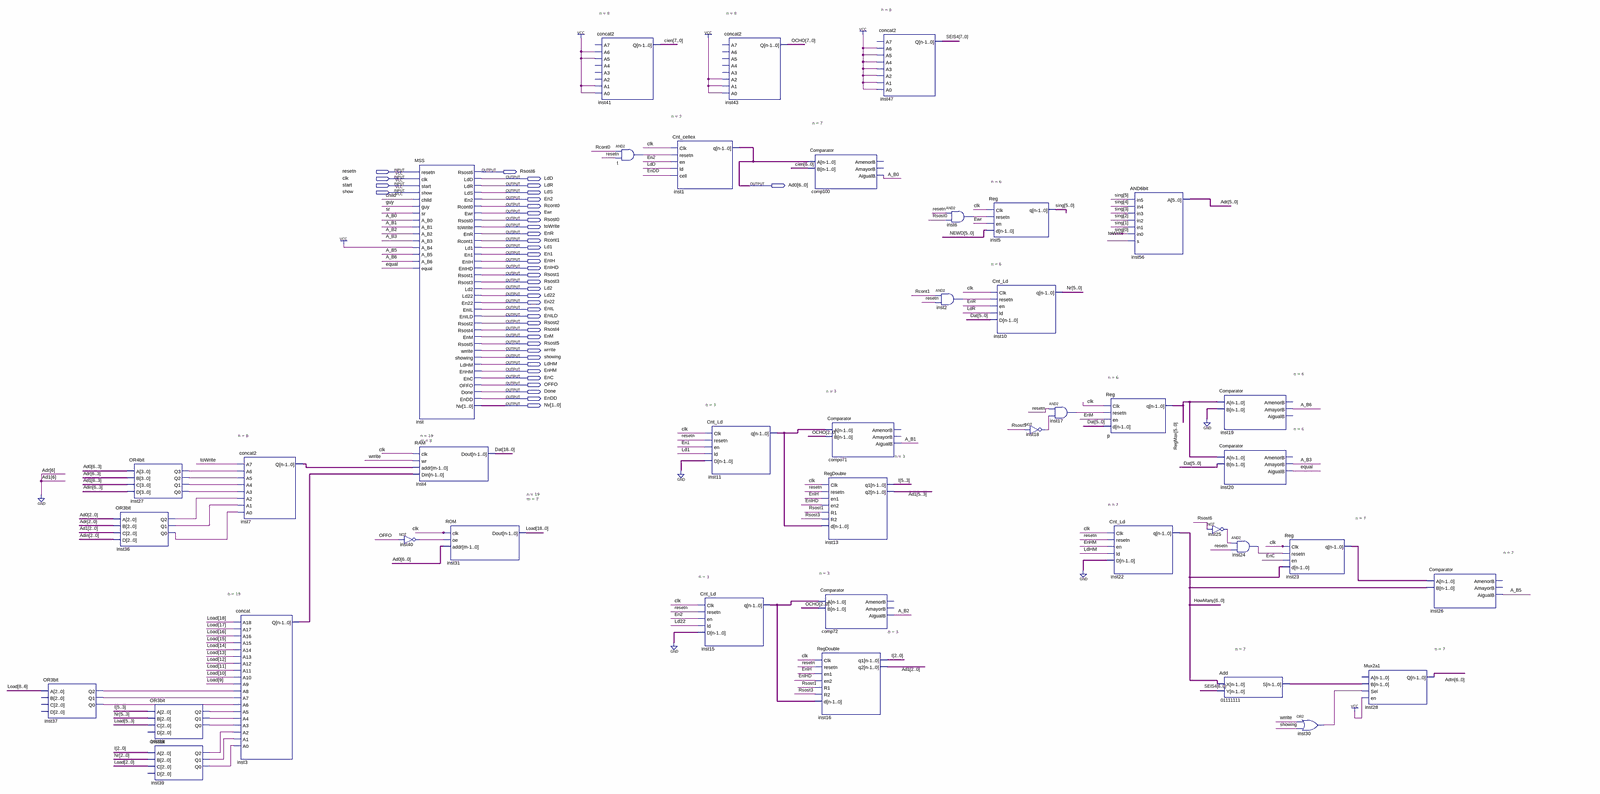
[diagram p0: schematic sheet, whole]
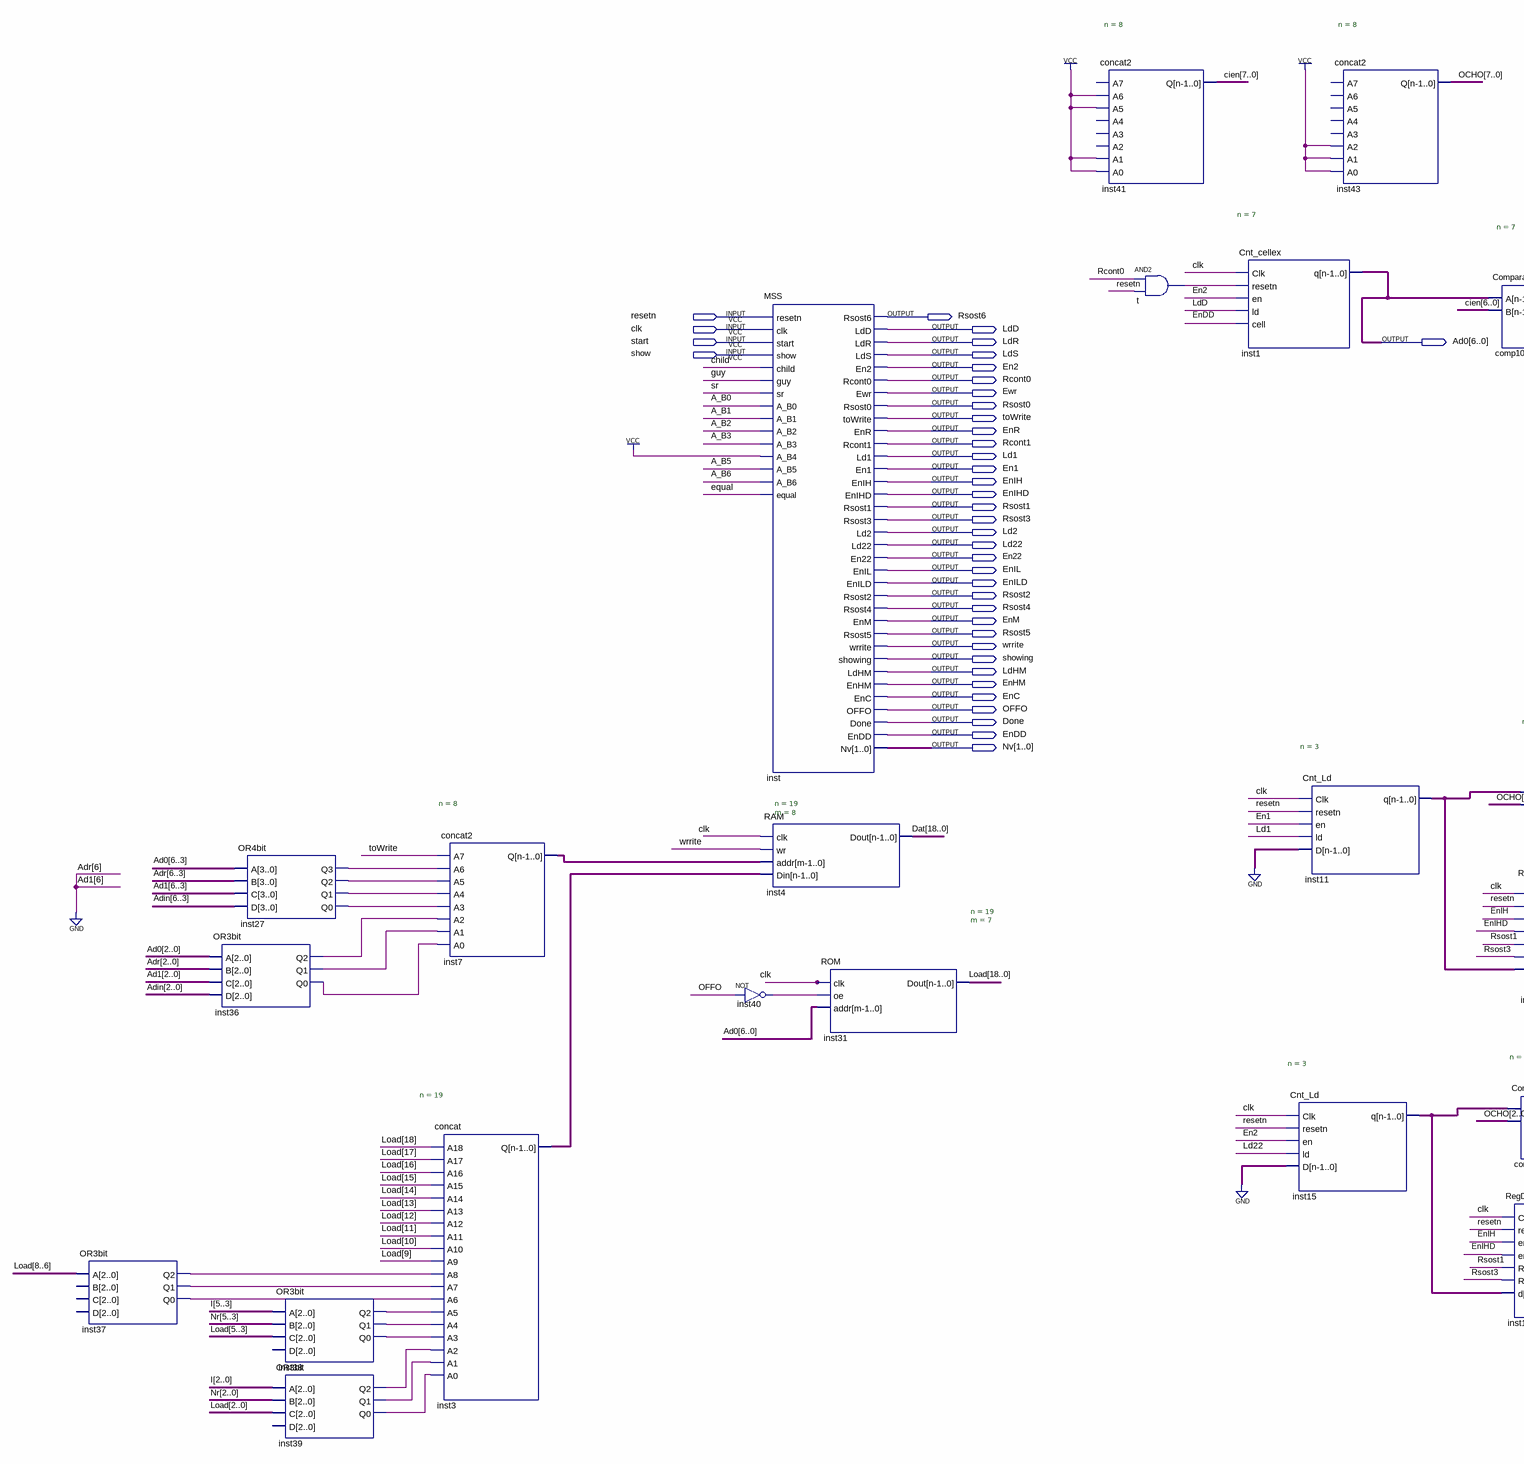
[diagram p1: schematic sheet, left part]
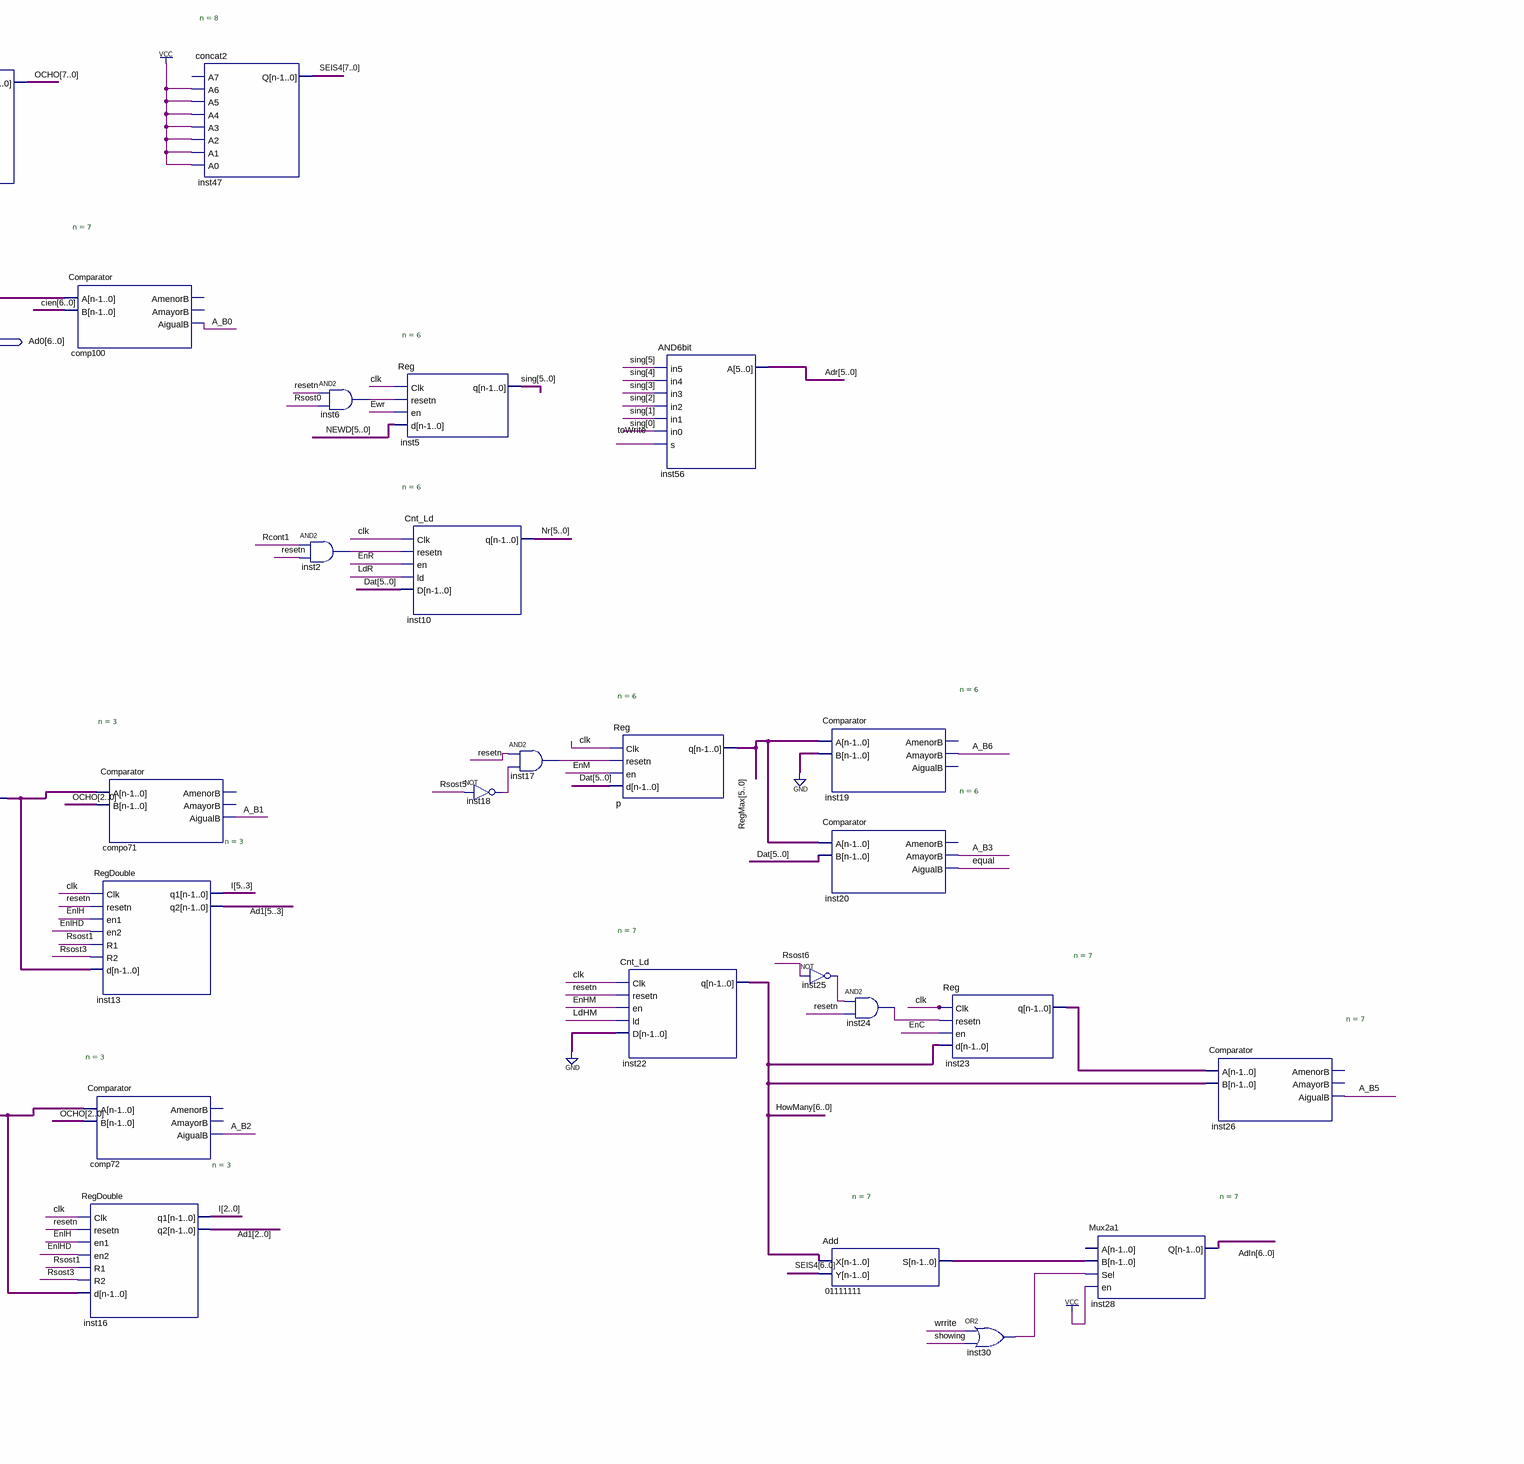
[diagram p2: schematic sheet, right part]
// Quartus schematic PROYECTOSDII.bdf as structural Verilog: 41 symbols, 40 pins
module PROYECTOSDII (
  input  resetn,
  input  clk,
  input  start,
  input  show,
  output Rsost6,
  output LdD,
  output LdR,
  output [6:0] Ad0,
  output LdS,
  output En2,
  output Rcont0,
  output Ewr,
  output Rsost0,
  output toWrite,
  output EnR,
  output Rcont1,
  output Ld1,
  output En1,
  output EnIH,
  output EnIHD,
  output Rsost1,
  output Rsost3,
  output Ld2,
  output Ld22,
  output En22,
  output EnIL,
  output EnILD,
  output Rsost2,
  output Rsost4,
  output EnM,
  output Rsost5,
  output wrrite,
  output showing,
  output LdHM,
  output EnHM,
  output EnC,
  output OFFO,
  output Done,
  output EnDD,
  output [1:0] Nv
);

  wire A_B0, A_B1, A_B2, A_B3, A_B5, A_B6, child, equal, guy, inst2_out, inst6_out, inst17_out, inst18_out,
       inst24_out, inst25_out, inst27_q0, inst27_q1, inst27_q2, inst27_q3, inst30_out, inst36_q0, inst36_q1,
       inst36_q2, inst37_q0, inst37_q1, inst37_q2, inst38_q0, inst38_q1, inst38_q2, inst39_q0, inst39_q1,
       inst39_q2, inst40_out, sr, t_out;
  wire [2:0] inst11_q, inst15_q;
  wire [5:0] Ad1, Adr, I, NEWD, Nr, RegMax, sing;
  wire [6:0] AdIn, HowMany, inst23_q, n01111111_s;
  wire [7:0] cien, inst7_q, OCHO, SEIS4;
  wire [18:0] Dat, inst3_q, Load;

  OR3bit inst37 (.A(Load[8:6]), .Q2(inst37_q2), .Q1(inst37_q1), .Q0(inst37_q0));  // open: B, C, D
  OR3bit inst36 (
    .A(Ad0[2:0]), .B(Adr[2:0]), .C(Ad1[2:0]), .D(AdIn[2:0]), .Q2(inst36_q2), .Q1(inst36_q1), .Q0(inst36_q0));
  OR4bit inst27 (
    .A(Ad0[6:3]), .B({1'b0, Adr[5:3]}), .C({1'b0, Ad1[5:3]}), .D(AdIn[6:3]), .Q3(inst27_q3), .Q2(inst27_q2),
    .Q1(inst27_q1), .Q0(inst27_q0));
  OR3bit inst38 (.A(I[5:3]), .B(Nr[5:3]), .C(Load[5:3]), .Q2(inst38_q2), .Q1(inst38_q1), .Q0(inst38_q0));  // open: D
  OR3bit inst39 (.A(I[2:0]), .B(Nr[2:0]), .C(Load[2:0]), .Q2(inst39_q2), .Q1(inst39_q1), .Q0(inst39_q0));  // open: D
  concat2 #(.n(8)) inst7 (
    .A7(toWrite), .A6(inst27_q3), .A5(inst27_q2), .A4(inst27_q1), .A3(inst27_q0), .A2(inst36_q2),
    .A1(inst36_q1), .A0(inst36_q0), .Q(inst7_q));
  concat #(.n(19)) inst3 (
    .A18(Load[18]), .A17(Load[17]), .A16(Load[16]), .A15(Load[15]), .A14(Load[14]), .A13(Load[13]),
    .A12(Load[12]), .A11(Load[11]), .A10(Load[10]), .A9(Load[9]), .A8(inst37_q2), .A7(inst37_q1),
    .A6(inst37_q0), .A5(inst38_q2), .A4(inst38_q1), .A3(inst38_q0), .A2(inst39_q2), .A1(inst39_q1),
    .A0(inst39_q0), .Q(inst3_q));
  MSS inst (
    .resetn(resetn), .clk(clk), .start(start), .show(show), .child(child), .guy(guy), .sr(sr), .A_B0(A_B0),
    .A_B1(A_B1), .A_B2(A_B2), .A_B3(A_B3), .A_B4(1'b1), .A_B5(A_B5), .A_B6(A_B6), .equal(equal),
    .Rsost6(Rsost6), .LdD(LdD), .LdR(LdR), .LdS(LdS), .En2(En2), .Rcont0(Rcont0), .Ewr(Ewr), .Rsost0(Rsost0),
    .toWrite(toWrite), .EnR(EnR), .Rcont1(Rcont1), .Ld1(Ld1), .En1(En1), .EnIH(EnIH), .EnIHD(EnIHD),
    .Rsost1(Rsost1), .Rsost3(Rsost3), .Ld2(Ld2), .Ld22(Ld22), .En22(En22), .EnIL(EnIL), .EnILD(EnILD),
    .Rsost2(Rsost2), .Rsost4(Rsost4), .EnM(EnM), .Rsost5(Rsost5), .wrrite(wrrite), .showing(showing),
    .LdHM(LdHM), .EnHM(EnHM), .EnC(EnC), .OFFO(OFFO), .Done(Done), .EnDD(EnDD), .Nv(Nv));
  RAM #(.n(19), .m(8)) inst4 (.clk(clk), .wr(wrrite), .addr(inst7_q), .Din(inst3_q), .Dout(Dat));
  not inst40 (inst40_out, OFFO);
  ROM #(.n(19), .m(7)) inst31 (.clk(clk), .oe(inst40_out), .addr(Ad0), .Dout(Load));
  concat2 #(.n(8)) inst41 (.A6(1'b1), .A5(1'b1), .A1(1'b1), .A0(1'b1), .Q(cien));  // open: A7, A4, A3, A2
  and t (t_out, Rcont0, resetn);
  Cnt_cellex #(.n(7)) inst1 (.Clk(clk), .resetn(t_out), .en(En2), .ld(LdD), .\cell (EnDD), .q(Ad0));
  concat2 #(.n(8)) inst43 (.A2(1'b1), .A1(1'b1), .A0(1'b1), .Q(OCHO));  // open: A7, A6, A5, A4, A3
  Cnt_Ld #(.n(3)) inst11 (.Clk(clk), .resetn(resetn), .en(En1), .ld(Ld1), .D(3'b000), .q(inst11_q));
  Cnt_Ld #(.n(3)) inst15 (.Clk(clk), .resetn(resetn), .en(En2), .ld(Ld22), .D(3'b000), .q(inst15_q));
  Comparator #(.n(7)) comp100 (.A(Ad0), .B(cien[6:0]), .AigualB(A_B0));  // open: AmenorB, AmayorB
  Comparator #(.n(3)) compo71 (.A(inst11_q), .B(OCHO[2:0]), .AigualB(A_B1));  // open: AmenorB, AmayorB
  RegDouble #(.n(3)) inst13 (
    .Clk(clk), .resetn(resetn), .en1(EnIH), .en2(EnIHD), .R1(Rsost1), .R2(Rsost3), .d(inst11_q), .q1(I[5:3]),
    .q2(Ad1[5:3]));
  Comparator #(.n(3)) comp72 (.A(inst15_q), .B(OCHO[2:0]), .AigualB(A_B2));  // open: AmenorB, AmayorB
  RegDouble #(.n(3)) inst16 (
    .Clk(clk), .resetn(resetn), .en1(EnIH), .en2(EnIHD), .R1(Rsost1), .R2(Rsost3), .d(inst15_q), .q1(I[2:0]),
    .q2(Ad1[2:0]));
  concat2 #(.n(8)) inst47 (
    .A6(1'b1), .A5(1'b1), .A4(1'b1), .A3(1'b1), .A2(1'b1), .A1(1'b1), .A0(1'b1), .Q(SEIS4));  // open: A7
  and inst2 (inst2_out, Rcont1, resetn);
  and inst6 (inst6_out, resetn, Rsost0);
  Reg #(.n(6)) inst5 (.Clk(clk), .resetn(inst6_out), .en(Ewr), .d(NEWD), .q(sing));
  Cnt_Ld #(.n(6)) inst10 (.Clk(clk), .resetn(inst2_out), .en(EnR), .ld(LdR), .D(Dat[5:0]), .q(Nr));
  not inst18 (inst18_out, Rsost5);
  and inst17 (inst17_out, resetn, inst18_out);
  Reg #(.n(6)) p (.Clk(clk), .resetn(inst17_out), .en(EnM), .d(Dat[5:0]), .q(RegMax));
  Cnt_Ld #(.n(7)) inst22 (.Clk(clk), .resetn(resetn), .en(EnHM), .ld(LdHM), .D({7{1'b0}}), .q(HowMany));
  AND6bit inst56 (
    .in5(sing[5]), .in4(sing[4]), .in3(sing[3]), .in2(sing[2]), .in1(sing[1]), .in0(sing[0]), .s(toWrite),
    .A(Adr));
  Comparator #(.n(6)) inst19 (.A(RegMax), .B({6{1'b0}}), .AmayorB(A_B6));  // open: AmenorB, AigualB
  Comparator #(.n(6)) inst20 (.A(RegMax), .B(Dat[5:0]), .AmayorB(A_B3), .AigualB(equal));  // open: AmenorB
  not inst25 (inst25_out, Rsost6);
  Add #(.n(7)) u_01111111 (.X(HowMany), .Y(SEIS4[6:0]), .S(n01111111_s));
  and inst24 (inst24_out, inst25_out, resetn);
  Reg #(.n(7)) inst23 (.Clk(clk), .resetn(inst24_out), .en(EnC), .d(HowMany), .q(inst23_q));
  or inst30 (inst30_out, wrrite, showing);
  Mux2a1 #(.n(7)) inst28 (.B(n01111111_s), .Sel(inst30_out), .en(1'b1), .Q(AdIn));  // open: A
  Comparator #(.n(7)) inst26 (.A(inst23_q), .B(HowMany), .AigualB(A_B5));  // open: AmenorB, AmayorB
endmodule
